# Altium schematic sheet BatteryMainSystem.SchDoc
size A4; SheetNumber: 1; SheetTotal: 4
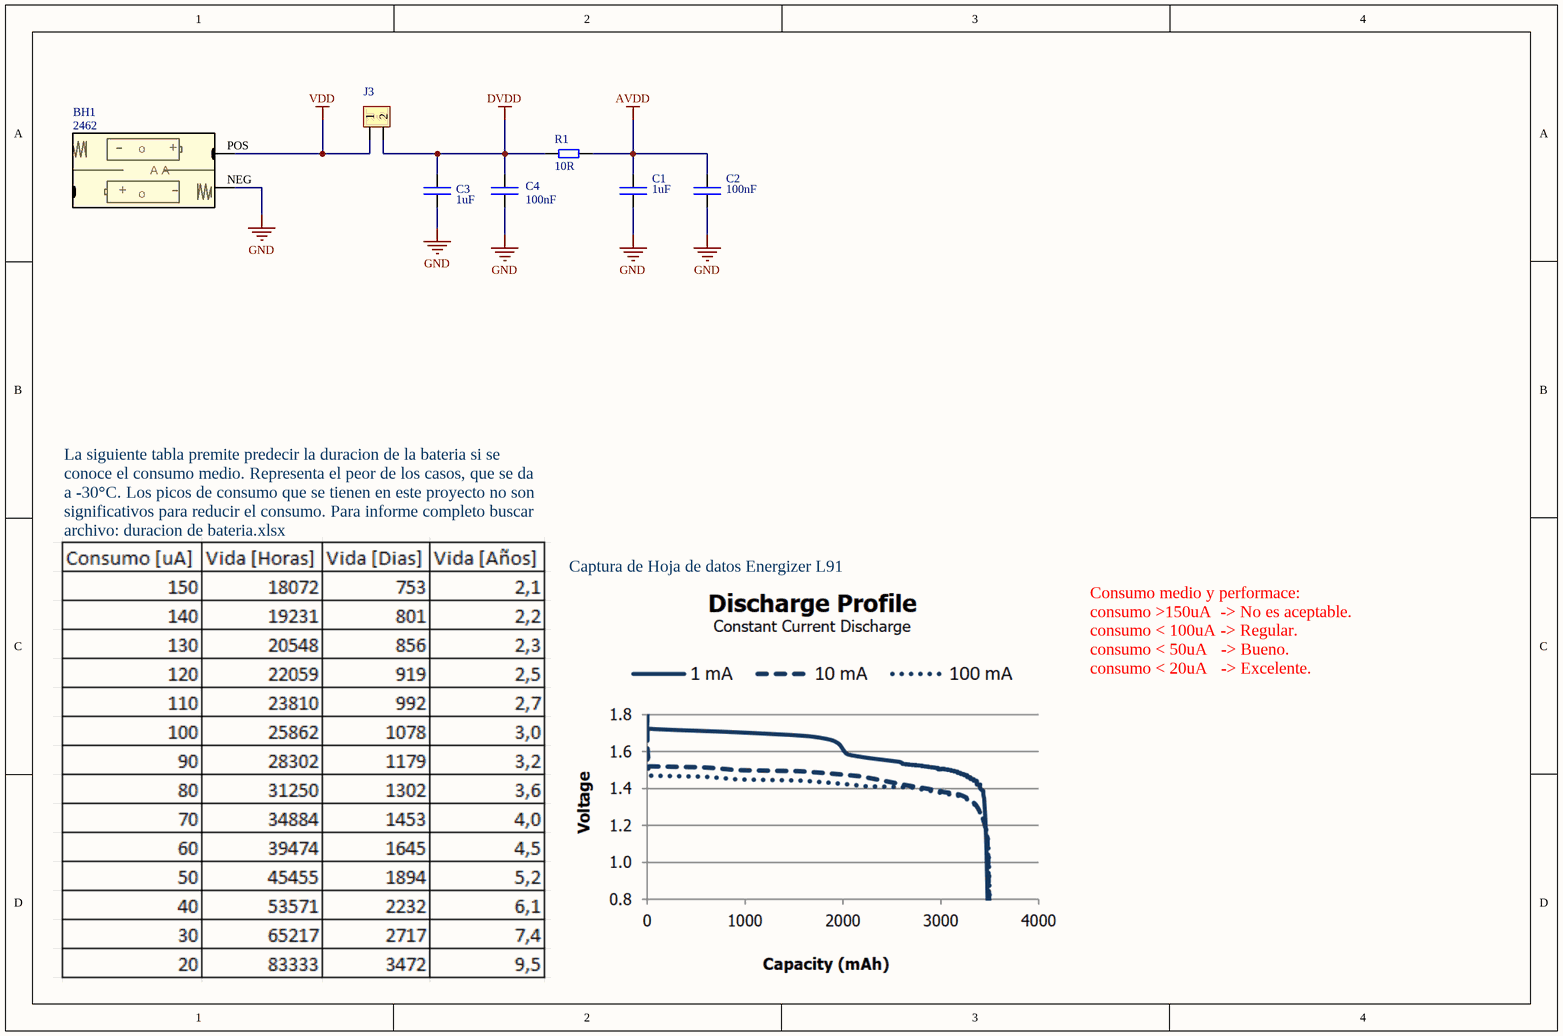
[diagram p0: BatteryMainSystem.SchDoc]

## Parts
BH1  2462  [BATTERY_HOLDER_2XAA]
C1  1uF  [CAP_SM0603_YAGEOCC2_N]
C2  100nF  [CAP_SM0603_YAGEOCC2_N]
C3  1uF  [CAP_SM0603_YAGEOCC2_N]
C4  100nF  [CAP_SM0603_YAGEOCC2_N]
J3  54101-T0600LF-CUT-2  [HEADER PIN 1X2]  (value not drawn)
R1  10R  [RES_SM0603_YAGEORC_N]

## Nets
AVDD: C1.1 C2.1 R1.2
DVDD: C3.1 C4.1 J3.2 R1.1
GND: BH1.NEG C1.2 C2.2 C3.2 C4.2
VDD: BH1.POS J3.1

## Notes on the sheet
- La siguiente tabla premite predecir la duracion de la bateria si se conoce el consumo medio. Representa el peor de los casos, que se da a -30°C. Los picos de consumo que se tienen en este proyecto no son significativos para reducir el consumo. Para informe completo buscar archivo: duracion de bateria.xlsx
- Captura de Hoja de datos Energizer L91
- Consumo medio y performace:
  consumo >150uA  -> No es aceptable.
  consumo < 100uA -> Regular.
  consumo < 50uA   -> Bueno.
  consumo < 20uA   -> Excelente.
- Title:
- Size: A4
- Date:
- FMC-320U MODEL A
- Sheet:
- Time:
- Of:
- Version:
- Revision:
- Release:
- 1
- 0
- FLOWMEET SRL
- File
- (in symbol 2462) +; A A

## Library data of the parts
BH1 = 2462: Battery holder 2XAA TH; Manufacturer: Keystone; Manufacturer Part Number: 2462; Category: Battery holder; Datasheet: https://www.keyelco.com/userAssets/file/M65p28.pdf; Temperature Max: -; Temperature Min: -
C1 C3 = CC0603KRX7R6BB105: CAP 1uF SM0603 X7R 10V YAGEO CC2; Tolerance (%): 5; Voltage Rating (Volts): 50; Category: Capacitor; Manufacturer: Yageo; Manufacturer Part Number: CC0603KRX7R6BB105; Package: 0603; Value: 1uF; ComponentLink1URL: http://www.yageo.com; ComponentLink1Description: Manufacturer Website; Datasheet: https://datasheet.lcsc.com/lcsc/2304140030_YAGEO-CC0603KRX7R6BB105_C113807.pdf
C2 C4 = CC0603KRX7R9BB104: CAP 100nF SM0603 X7R 50V YAGEO CC2; Tolerance (%): 10; Voltage Rating (Volts): 50; Category: Capacitor; Manufacturer: Yageo; Manufacturer Part Number: CC0603KRX7R9BB104; Package: 0603; Value: 100nF; Supplier Part Number 1: 1362556; Supplier 1: Farnell; ComponentLink1URL: http://www.yageo.com; ComponentLink1Description: Manufacturer Website; Supplier 2: Digi-Key; Supplier Part Number 2: 311-1344-1-ND; Datasheet: https://datasheet.lcsc.com/lcsc/2211101700_YAGEO-CC0603KRX7R9BB104_C14663.pdf
J3 = 54101-T0600LF-CUT-2: Pin header pitch 2.54 TH - cuttable 2 od 36 positions.; Manufacturer: Amphenol ICC; Fraction: 2/36; Manufacturer Part Number: 54101-T0600LF; Vendor: *; Vendor Part Number: *
R1 = RC0603FR-0710RL: RES 10R SM0603 YAGEO RC_L; Power (Watts): 0.1; Resistance (Ohms): 10; Tolerance (%): 1; Category: Resistor; Manufacturer: Yageo; Manufacturer Part Number: RC0603FR-0710RL; Package: 0603; Value: 10R; Supplier Part Number 1: 9238247; Supplier 1: Farnell; ComponentLink1Description: Manufacturer Website; ComponentLink1URL: http://www.yageo.com; Supplier 2: Digi-Key; Supplier Part Number 2: 311-10.0HRCT-ND